# Altium schematic sheet P11_Exp Conn, uSD.SchDoc
size 386 x 246 mm
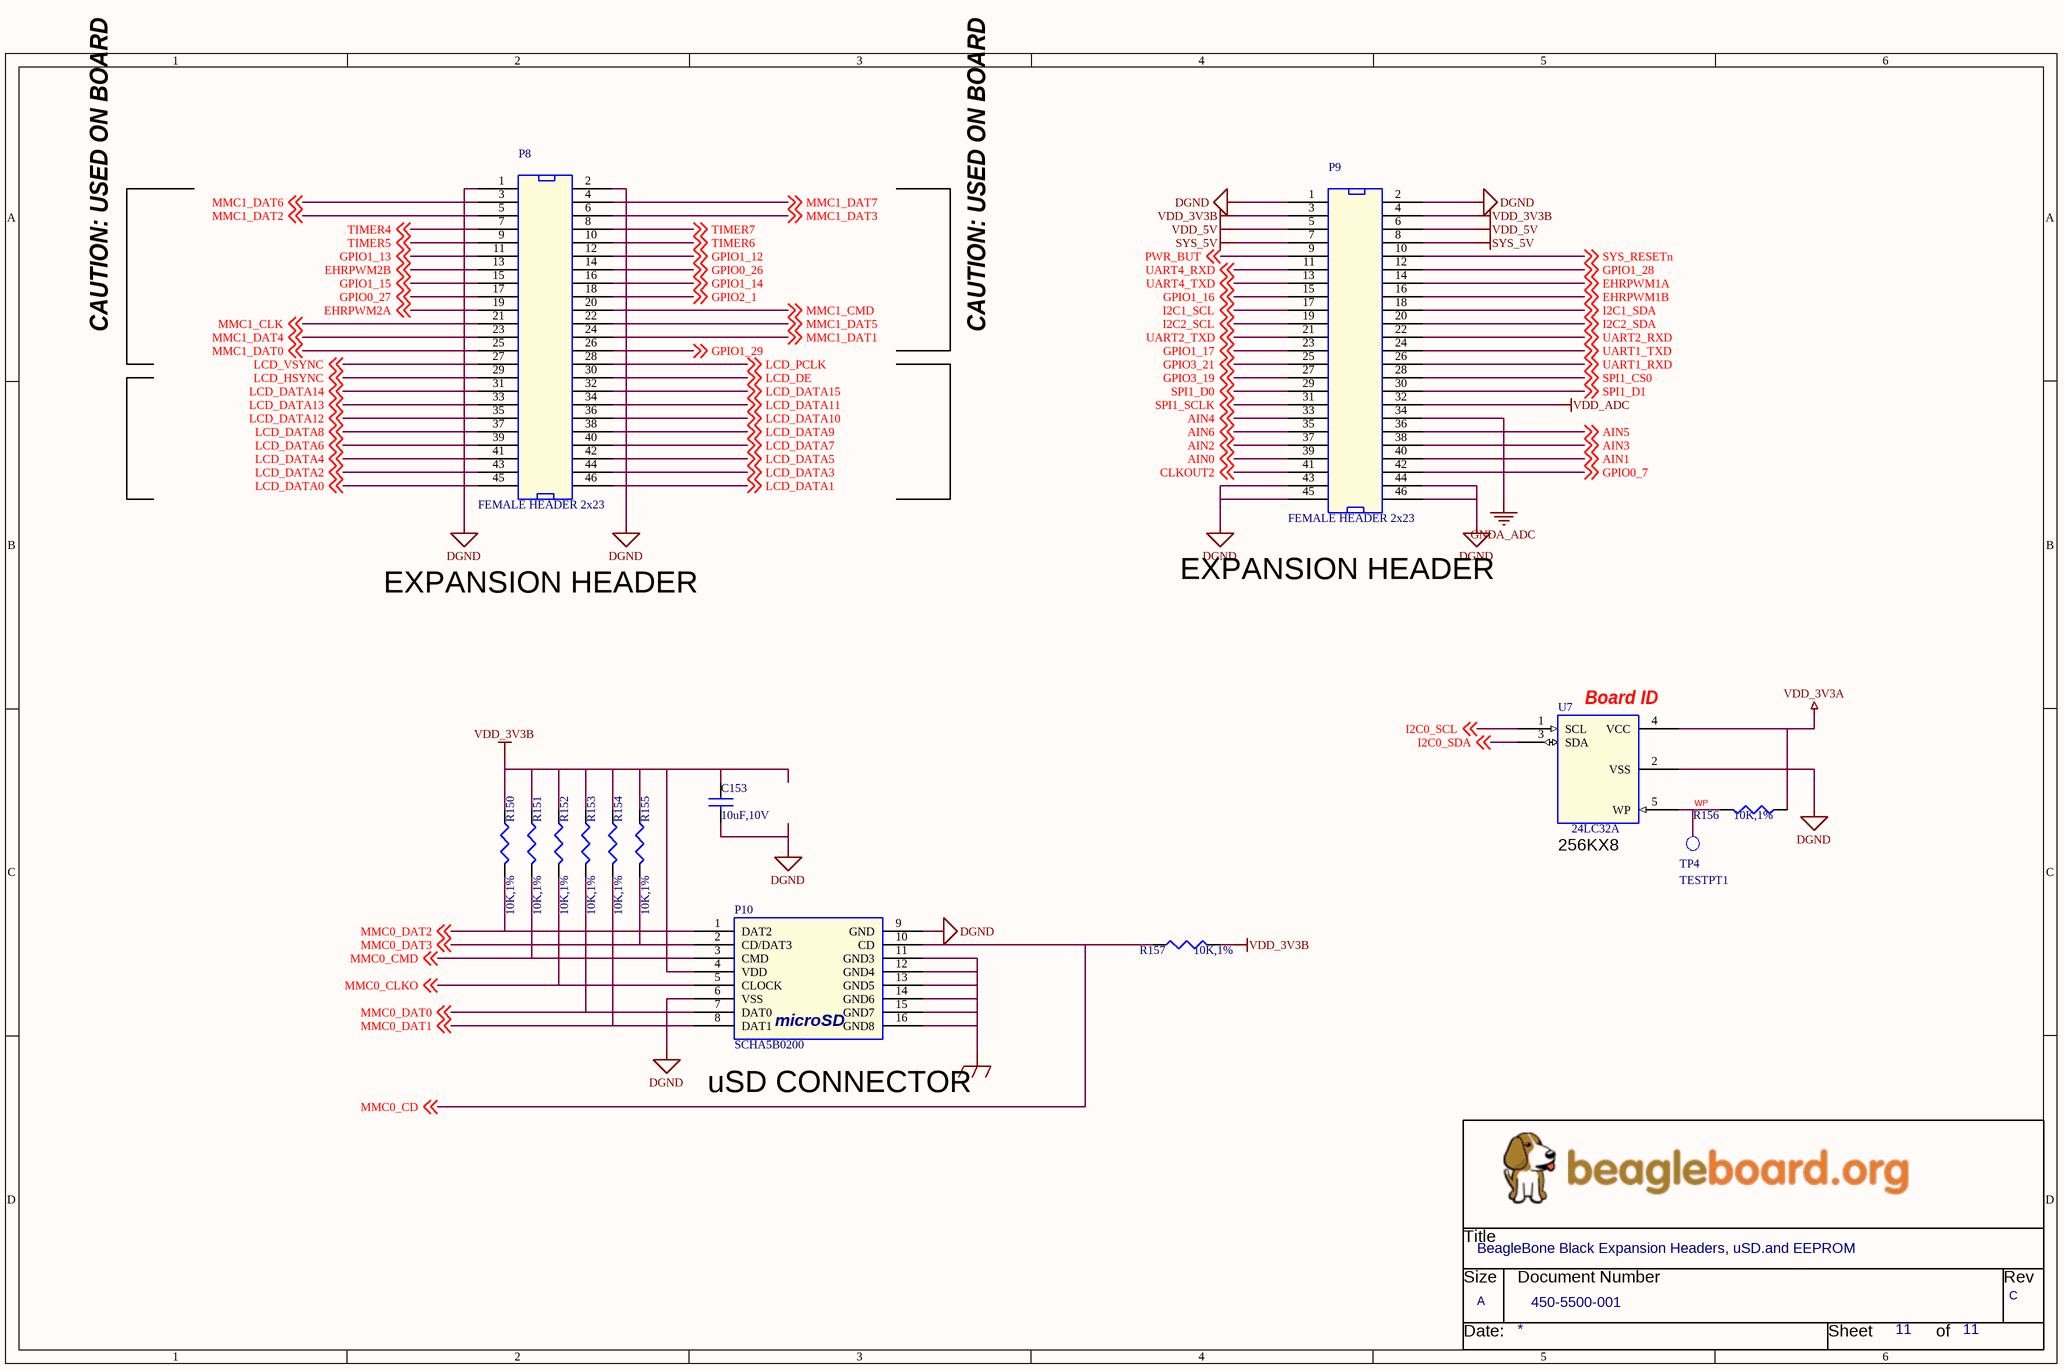
[diagram p0: P11_Exp Conn, uSD.SchDoc]

## Parts
*  Page Count: 11  Page Size: A  Title: BeagleBone Black Expansion Headers, uSD.and EEPROM  RevCode: C  Doc: 450-5500-001  (hidden comment: BeagleBoard_org)  (graphical)
C153  10uF,10V  [r402-25rd]
P8  FEMALE HEADER 2x23  [HEADER23X2]
P9  FEMALE HEADER 2x23  [HEADER23X2]
P10  SCHA5B0200  [SM-CON-MOLEX-54794-0918]
R150  10K,1%  [402]
R151  10K,1%  [402]
R152  10K,1%  [402]
R153  10K,1%  [402]
R154  10K,1%  [402]
R155  10K,1%  [402]
R156  10K,1%  [402]
R157  10K,1%  [402]
TP4  TESTPT1  [tp1-8040]
U7  24LC32A  [SOIC_8]

## Nets
DGND: C153.2 P8.1 P8.2 P9.1 P9.2 P9.43 P9.44 P9.45 P9.46 P10.6(VSS) P10.9(GND) U7.2(VSS)
GND_EARTH: P10.11(GND3) P10.12(GND4) P10.13(GND5) P10.14(GND6) P10.15(GND7) P10.16(GND8)
GNDA_ADC: P9.34
SYS_5V: P9.7 P9.8
VDD_3V3A: R156.1 U7.4(VCC)
VDD_3V3B: C153.1 P9.3 P9.4 P10.4(VDD) R150.1 R151.1 R152.1 R153.1 R154.1 R155.1 R157.2
VDD_5V: P9.5 P9.6
VDD_ADC: P9.32
AIN0: P9.39 ; off-sheet AIN0
AIN1: P9.40 ; off-sheet AIN1
AIN2: P9.37 ; off-sheet AIN2
AIN3: P9.38 ; off-sheet AIN3
AIN4: P9.33 ; off-sheet AIN4
AIN5: P9.36 ; off-sheet AIN5
AIN6: P9.35 ; off-sheet AIN6
CLKOUT2: P9.41 ; off-sheet CLKOUT2
EHRPWM1A: P9.14 ; off-sheet EHRPWM1A
EHRPWM1B: P9.16 ; off-sheet EHRPWM1B
EHRPWM2A: P8.19 ; off-sheet EHRPWM2A
EHRPWM2B: P8.13 ; off-sheet EHRPWM2B
GPIO0_7: P9.42 ; off-sheet GPIO0_7
GPIO0_26: P8.14 ; off-sheet GPIO0_26
GPIO0_27: P8.17 ; off-sheet GPIO0_27
GPIO1_12: P8.12 ; off-sheet GPIO1_12
GPIO1_13: P8.11 ; off-sheet GPIO1_13
GPIO1_14: P8.16 ; off-sheet GPIO1_14
GPIO1_15: P8.15 ; off-sheet GPIO1_15
GPIO1_16: P9.15 ; off-sheet GPIO1_16
GPIO1_17: P9.23 ; off-sheet GPIO1_17
GPIO1_28: P9.12 ; off-sheet GPIO1_28
GPIO1_29: P8.26 ; off-sheet GPIO1_29
GPIO2_1: P8.18 ; off-sheet GPIO2_1
GPIO3_19: P9.27 ; off-sheet GPIO3_19
GPIO3_21: P9.25 ; off-sheet GPIO3_21
I2C0_SCL: U7.1(SCL) ; off-sheet I2C0_SCL
I2C0_SDA: U7.3(SDA) ; off-sheet I2C0_SDA
I2C1_SCL: P9.17 ; off-sheet I2C1_SCL
I2C1_SDA: P9.18 ; off-sheet I2C1_SDA
I2C2_SCL: P9.19 ; off-sheet I2C2_SCL
I2C2_SDA: P9.20 ; off-sheet I2C2_SDA
LCD_DATA0: P8.45 ; off-sheet LCD_DATA0
LCD_DATA1: P8.46 ; off-sheet LCD_DATA1
LCD_DATA2: P8.43 ; off-sheet LCD_DATA2
LCD_DATA3: P8.44 ; off-sheet LCD_DATA3
LCD_DATA4: P8.41 ; off-sheet LCD_DATA4
LCD_DATA5: P8.42 ; off-sheet LCD_DATA5
LCD_DATA6: P8.39 ; off-sheet LCD_DATA6
LCD_DATA7: P8.40 ; off-sheet LCD_DATA7
LCD_DATA8: P8.37 ; off-sheet LCD_DATA8
LCD_DATA9: P8.38 ; off-sheet LCD_DATA9
LCD_DATA10: P8.36 ; off-sheet LCD_DATA10
LCD_DATA11: P8.34 ; off-sheet LCD_DATA11
LCD_DATA12: P8.35 ; off-sheet LCD_DATA12
LCD_DATA13: P8.33 ; off-sheet LCD_DATA13
LCD_DATA14: P8.31 ; off-sheet LCD_DATA14
LCD_DATA15: P8.32 ; off-sheet LCD_DATA15
LCD_DE: P8.30 ; off-sheet LCD_DE
LCD_HSYNC: P8.29 ; off-sheet LCD_HSYNC
LCD_PCLK: P8.28 ; off-sheet LCD_PCLK
LCD_VSYNC: P8.27 ; off-sheet LCD_VSYNC
MMC0_CD: P10.10(CD) R157.1 ; off-sheet MMC0_CD
MMC0_CLKO: P10.5(CLOCK) R152.2 ; off-sheet MMC0_CLKO
MMC0_CMD: P10.3(CMD) R151.2 ; off-sheet MMC0_CMD
MMC0_DAT0: P10.7(DAT0) R153.2 ; off-sheet MMC0_DAT0
MMC0_DAT1: P10.8(DAT1) R154.2 ; off-sheet MMC0_DAT1
MMC0_DAT2: P10.1(DAT2) R150.2 ; off-sheet MMC0_DAT2
MMC0_DAT3: P10.2(CD/DAT3) R155.2 ; off-sheet MMC0_DAT3
MMC1_CLK: P8.21 ; off-sheet MMC1_CLK
MMC1_CMD: P8.20 ; off-sheet MMC1_CMD
MMC1_DAT0: P8.25 ; off-sheet MMC1_DAT0
MMC1_DAT1: P8.24 ; off-sheet MMC1_DAT1
MMC1_DAT2: P8.5 ; off-sheet MMC1_DAT2
MMC1_DAT3: P8.6 ; off-sheet MMC1_DAT3
MMC1_DAT4: P8.23 ; off-sheet MMC1_DAT4
MMC1_DAT5: P8.22 ; off-sheet MMC1_DAT5
MMC1_DAT6: P8.3 ; off-sheet MMC1_DAT6
MMC1_DAT7: P8.4 ; off-sheet MMC1_DAT7
PWR_BUT: P9.9 ; off-sheet PWR_BUT
SPI1_CS0: P9.28 ; off-sheet SPI1_CS0
SPI1_D0: P9.29 ; off-sheet SPI1_D0
SPI1_D1: P9.30 ; off-sheet SPI1_D1
SPI1_SCLK: P9.31 ; off-sheet SPI1_SCLK
SYS_RESETn: P9.10 ; off-sheet SYS_RESETn
TIMER4: P8.7 ; off-sheet TIMER4
TIMER5: P8.9 ; off-sheet TIMER5
TIMER6: P8.10 ; off-sheet TIMER6
TIMER7: P8.8 ; off-sheet TIMER7
UART1_RXD: P9.26 ; off-sheet UART1_RXD
UART1_TXD: P9.24 ; off-sheet UART1_TXD
UART2_RXD: P9.22 ; off-sheet UART2_RXD
UART2_TXD: P9.21 ; off-sheet UART2_TXD
UART4_RXD: P9.11 ; off-sheet UART4_RXD
UART4_TXD: P9.13 ; off-sheet UART4_TXD
WP: R156.2 TP4.1(TP) U7.5(WP)

## Notes on the sheet
- CAUTION: USED ON BOARD
- EXPANSION HEADER
- (near U7) Board ID
- (near U7) 256KX8
- (near P10) uSD CONNECTOR
- (in symbol BeagleBoard_org) Title; Size; Document Number; Rev; Date:; Sheet; of
- (in symbol microSD_CONN_8) microSD

## Library data of the parts
C153 = CAP_10uF_Y5V_10V_10%_0805: Desc: CAP CER 10UF 10V Y5V 0805; PCB Footprint: 805; Part Number: CAP_10uF_Y5V_10V_10%_0805
P8 P9 = HDR_46_F_2_0.1_0.1: PCB Footprint: HEADER23X2
P10 = microSD_CONN_8: Manufacturer: OMRON; ATLStockNo1: 4500.0144; TN: 224-0332-000; PCB Footprint: SD-MICRO-SCHA5B0300
R150-R155 R157 = RES_10K_1/16W_1%_0402_Dup1: Resistor 10Kohm 1/16W 1% 0402; Part Number: RES_10K_1/16W_1%_0402; PCB Footprint: 402
R156 = RES_0_1/16W_1%_0402_Dup1: Resistor Zero ohm Jumper 0402; Part Number: RES_0_1/16W_1%_0402; PCB Footprint: 402
U7 = MEM_24LC32_SOT23-5: EEPROM 256Kb I2C SOIC8; PartName: CAT24C256W; Mfr: On Semiconductor; MfrNum: CAT24C256WI-G; TIIntPartnumber: 1A0225; Vendor: Digikey; Cost100: 1.21; Cost10K: 0.27; PCB Footprint: SOIC8pintbd
* = BeagleBoard_org: Page Number: 11; Page Create Date: March  8, 1995; Page Modify Date: *
TP4 = TESTPT1: PCB Footprint: tp1-8040